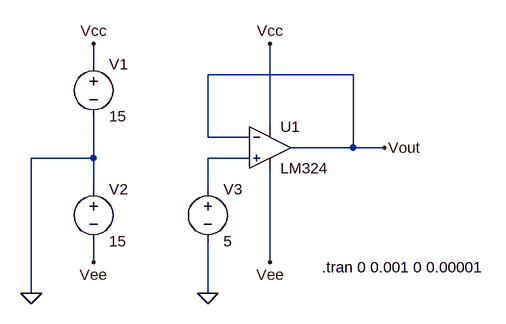
[diagram p0: schematic LM324 Test.asc]
LM324 Test.asc, the LTspice schematic file:
Version 4
SHEET 1 880 680
WIRE -128 64 -128 32
WIRE 272 80 48 80
WIRE 144 160 144 32
WIRE 48 176 48 80
WIRE 112 176 48 176
WIRE 272 192 272 80
WIRE 272 192 176 192
WIRE 320 192 272 192
WIRE -128 208 -128 144
WIRE -128 208 -224 208
WIRE 112 208 48 208
WIRE -128 256 -128 208
WIRE 48 256 48 208
WIRE -128 368 -128 336
WIRE 144 368 144 224
WIRE -224 416 -224 208
WIRE 48 416 48 336
FLAG -128 32 Vcc
FLAG -128 368 Vee
FLAG 320 192 Vout
FLAG 144 32 Vcc
FLAG 144 368 Vee
FLAG -224 416 0
FLAG 48 416 0
SYMBOL voltage -128 48 R0
SYMATTR InstName V1
SYMATTR Value 15
SYMBOL voltage -128 240 R0
SYMATTR InstName V2
SYMATTR Value 15
SYMBOL voltage 48 240 R0
SYMATTR InstName V3
SYMATTR Value 5
SYMBOL OpAmps\\LM324 144 128 R0
SYMATTR InstName U1
TEXT 224 376 Left 2 !.tran 0 0.001 0 0.00001

The netlist it stands for:
* LM324 Test.asc
V1 Vcc 0 15
V2 0 Vee 15
V3 N001 0 5
XU1 N001 Vout Vcc Vee Vout LM324  ; pins In+ In- V+ V- OUT
.tran 0 0.001 0 0.00001
.backanno
.end